# Altium schematic sheet 5_ADC.schdoc
size 307 x 218 mm; Symbol: A4空白; Device: A4空白; @Project Name: 34567890; @Page Count: 7; @Update Date: 2025-05-12; @Create Date: 2025-03-11; @Schematic Name: Schematic1; @Page No: 5; @Page Name: ADC; @Create Time: 07:05:34; @Board Name: PCB; @Update Time: 12:27:19; Title Block Position: 3; Width: 1170; Height: 825; Region Start: 1; X Region Count: 6; Y Region Count: 4; Blade Width: 10; SheetNumber: 5; SheetTotal: 7
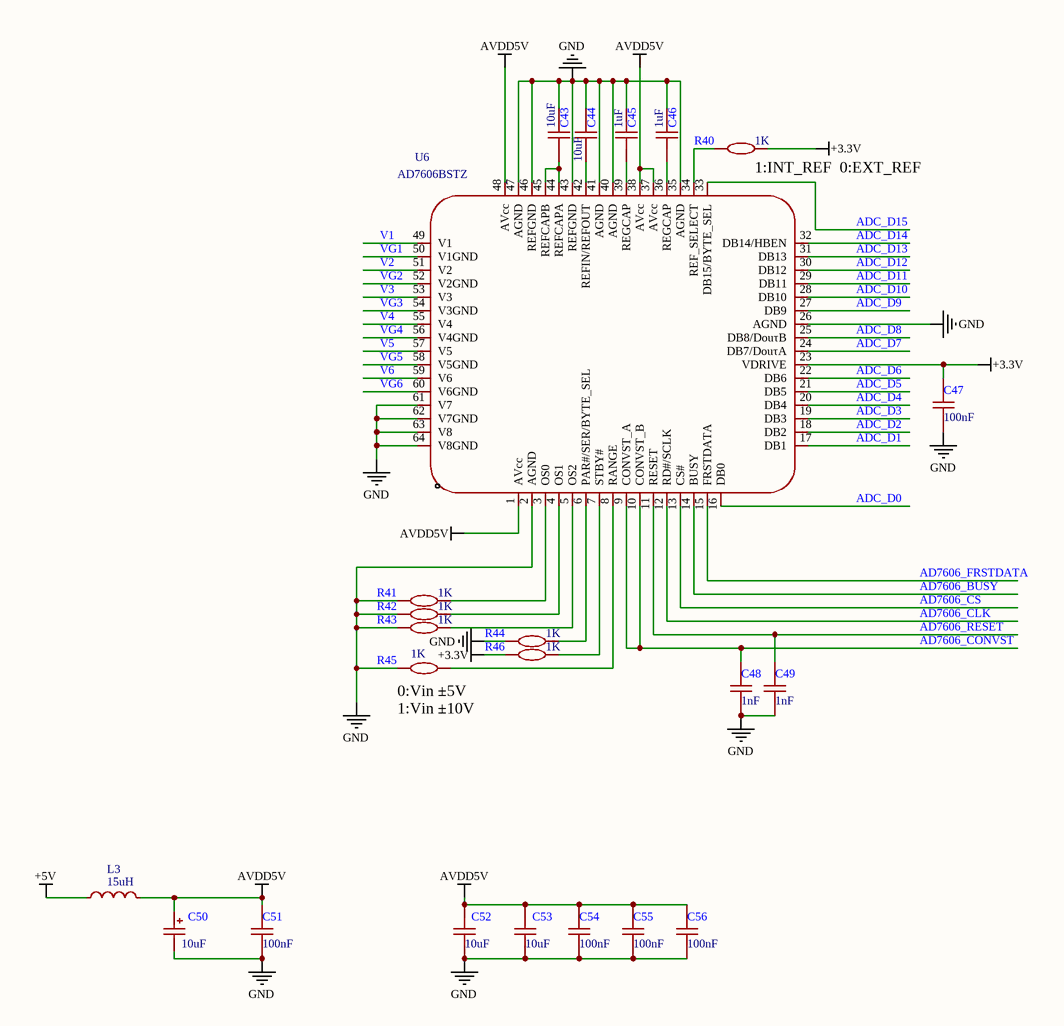
[diagram p0: 5_ADC.schdoc]

## Parts
C43  10uF  [C0805]
C44  10uF  [C0805]
C45  1uF  [C0603]
C46  1uF  [C0603]
C47  100nF  [C0603]
C48  1nF  [C0603]
C49  1nF  [C0603]
C50  10uF  [C_Ele_SMD_3x5.4mm]
C51  100nF  [C0603]
C52  10uF  [C0805]
C53  10uF  [C0805]
C54  100nF  [C0603]
C55  100nF  [C0603]
C56  100nF  [C0603]
L3  15uH  [IND-SMD_L7.1-W6.6_SLO0618H]
R40  1K  [R0603]
R41  1K  [R0603]
R42  1K  [R0603]
R43  1K  [R0603]
R44  1K  [R0603]
R45  1K  [R0603]
R46  1K  [R0603]
U6  AD7606BSTZ  [LQFP-64_L10.0-W10.0-P0.50-LS12.0-BL]

## Nets
+3.3V: C47.2 R40.2 R46.1 U6.23(VDRIVE)
+5V: L3.1
AVDD5V: C50.1 C51.2 C52.2 C53.2 C54.2 C55.2 C56.2 L3.2 U6.1(AVcc) U6.37(AVcc) U6.38(AVcc) U6.48(AVcc)
GND: C43.2 C44.2 C45.2 C46.2 C47.1 C48.1 C49.1 C50.2 C51.1 C52.1 C53.1 C54.1 C55.1 C56.1 R41.1 R42.1 R43.1 R44.1 R45.1 U6.2(AGND) U6.26(AGND) U6.35(AGND) U6.40(AGND) U6.41(AGND) U6.43(REFGND) U6.46(REFGND) U6.47(AGND) U6.61(V7) U6.62(V7GND) U6.63(V8) U6.64(V8GND)
AD7606_BUSY: U6.14(BUSY)
AD7606_CLK: U6.12(RD#/SCLK)
AD7606_CONVST: C48.2 U6.9(CONVST_A) U6.10(CONVST_B)
AD7606_CS: U6.13(CS#)
AD7606_FRSTDATA: U6.15(FRSTDATA)
AD7606_RESET: C49.2 U6.11(RESET)
ADC_D0: U6.16(DB0)
ADC_D1: U6.17(DB1)
ADC_D2: U6.18(DB2)
ADC_D3: U6.19(DB3)
ADC_D4: U6.20(DB4)
ADC_D5: U6.21(DB5)
ADC_D6: U6.22(DB6)
ADC_D7: U6.24(DB7/DouτA)
ADC_D8: U6.25(DB8/DouτB)
ADC_D9: U6.27(DB9)
ADC_D10: U6.28(DB10)
ADC_D11: U6.29(DB11)
ADC_D12: U6.30(DB12)
ADC_D13: U6.31(DB13)
ADC_D14: U6.32(DB14/HBEN)
ADC_D15: U6.33(DB15/BYTE_SEL)
V1: U6.49(V1)
V2: U6.51(V2)
V3: U6.53(V3)
V4: U6.55(V4)
V5: U6.57(V5)
V6: U6.59(V6)
VG1: U6.50(V1GND)
VG2: U6.52(V2GND)
VG3: U6.54(V3GND)
VG4: U6.56(V4GND)
VG5: U6.58(V5GND)
VG6: U6.60(V6GND)
NetC43_1: C43.1 U6.44(REFCAPA) U6.45(REFCAPB)
NetC44_1: C44.1 U6.42(REFIN/REFOUT)
NetC45_1: C45.1 U6.39(REGCAP)
NetC46_1: C46.1 U6.36(REGCAP)
NetR40_1: R40.1 U6.34(REF_SELECT)
NetR41_2: R41.2 U6.3(OS0)
NetR42_2: R42.2 U6.4(OS1)
NetR43_2: R43.2 U6.5(OS2)
NetR44_2: R44.2 U6.6(PAR#/SER/BYTE_SEL)
NetR45_2: R45.2 U6.8(RANGE)
NetR46_2: R46.2 U6.7(STBY#)

## Notes on the sheet
- 1:INT_REF  0:EXT_REF
- (near R45) 0:Vin ±5V
  1:Vin ±10V
- 1
- 2
- 3
- 4
- 5
- 6
- A
- B
- C
- D

## Library data of the parts
C43 C44 C52 C53 = CAP_0805: Device: CAP_0805
C45-C49 C51 C54-C56 = CAP_0603: Device: CAP_0603
C50 = C_Ele_SMD_3x5.4mm: Device: C_Ele_SMD_3x5.4mm
L3 = SLO0630H150MTT: Device: SLO0630H150MTT
R40-R46 = Res_0603: Device: Res_0603
U6 = AD7606BSTZ: Device: AD7606BSTZ